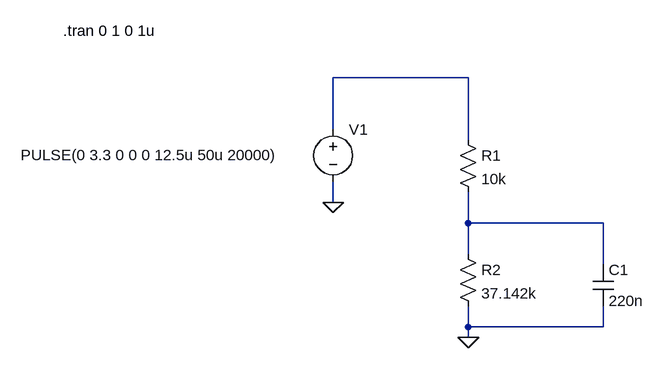
[diagram p0: schematic MOTOR_REF_LOWPASS.asc]
MOTOR_REF_LOWPASS.asc, the LTspice schematic file:
Version 4.1
SHEET 1 880 680
WIRE 208 16 0 16
WIRE 0 96 0 16
WIRE 208 112 208 16
WIRE 0 208 0 176
WIRE 208 240 208 192
WIRE 416 240 208 240
WIRE 208 288 208 240
WIRE 416 304 416 240
WIRE 208 400 208 368
WIRE 416 400 416 368
WIRE 416 400 208 400
WIRE 208 416 208 400
FLAG 0 208 0
FLAG 208 416 0
SYMBOL voltage 0 80 R0
WINDOW 3 -481 55 Left 2
WINDOW 123 0 0 Left 0
WINDOW 39 0 0 Left 0
SYMATTR InstName V1
SYMATTR Value PULSE(0 3.3 0 0 0 12.5u 50u 20000)
SYMBOL res 192 96 R0
SYMATTR InstName R1
SYMATTR Value 10k
SYMBOL res 192 272 R0
SYMATTR InstName R2
SYMATTR Value 37.142k
SYMBOL cap 400 304 R0
SYMATTR InstName C1
SYMATTR Value 220n
TEXT -416 -56 Left 2 !.tran 0 1 0 1u

The netlist it stands for:
* MOTOR_REF_LOWPASS.asc
V1 N001 0 PULSE(0 3.3 0 0 0 12.5u 50u 20000)
R1 N001 N002 10k
R2 N002 0 37.142k
C1 N002 0 220n
.tran 0 1 0 1u
.backanno
.end